# Altium project DEMO.PrjPcb
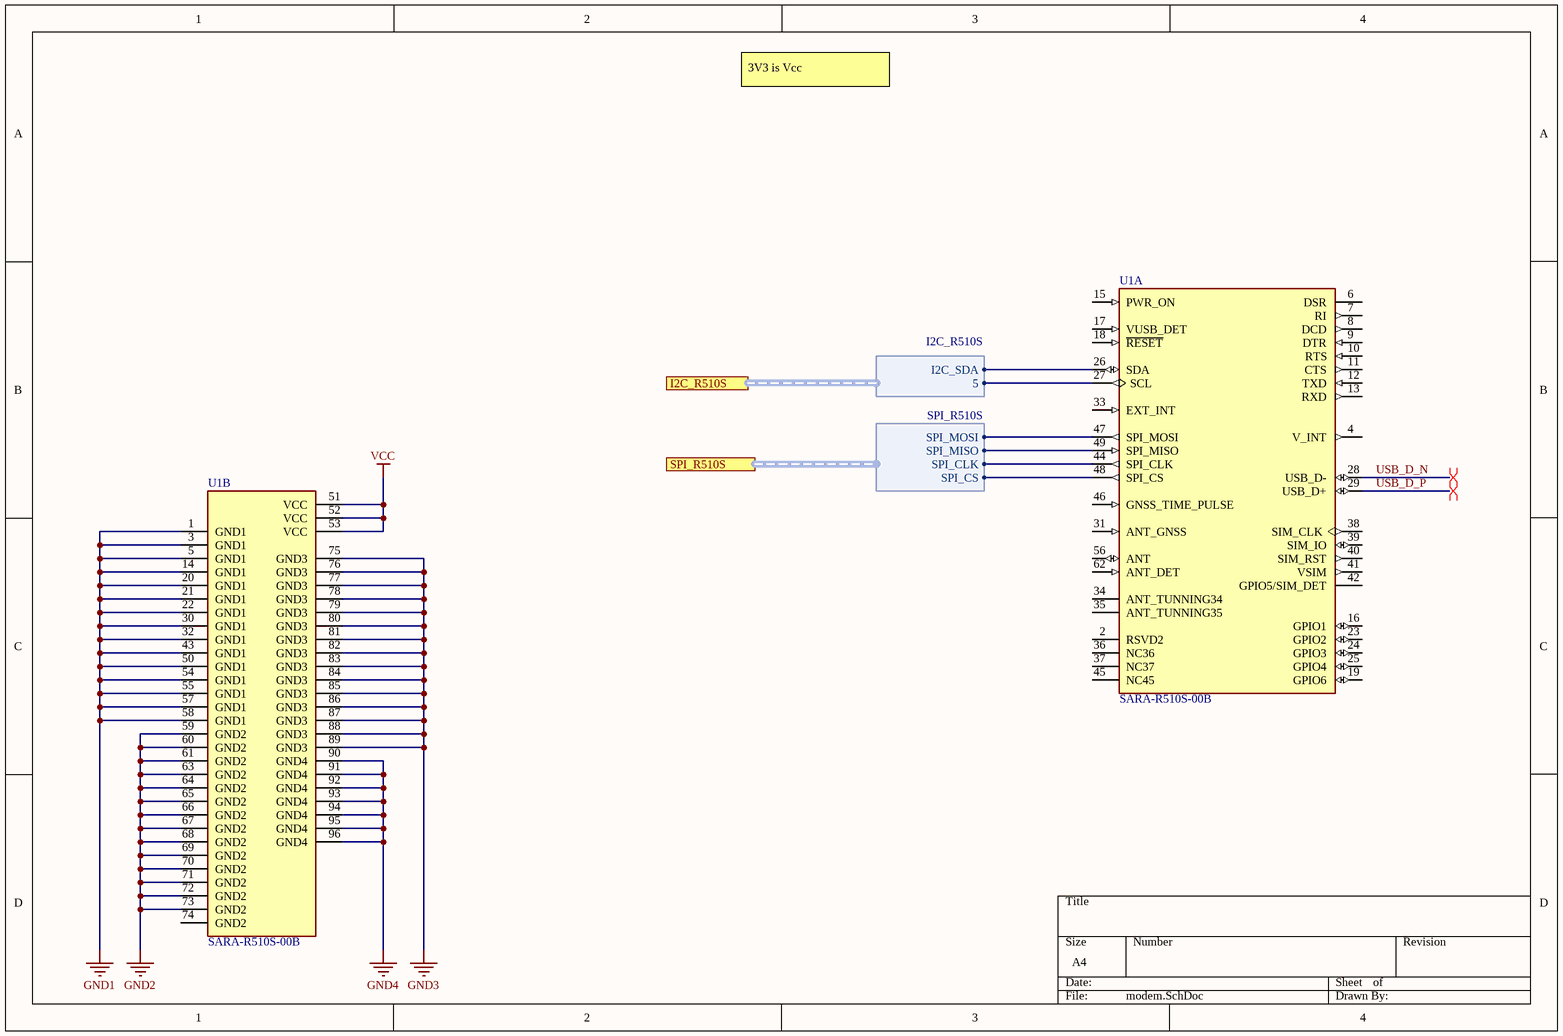
[diagram p0: modem.SchDoc]
9 sheets, 59 parts. Net scope: hierarchical (ports join the sheet entries above them; power ports are global).
Board file: TEST.PcbDoc
Sheets:
  modem.SchDoc
  nRF.SchDoc
  USB_C.SchDoc
  example connect.SchDoc
    Designator = ATMEGA328PB_example.SchDoc
    Designator = componant_example.SchDoc
    USB_in = USB_C2.SchDoc
    Designator = USB_to_UART.SchDoc
    Designator = SPI_8_bit display.SchDoc

## Sheet modem.SchDoc
size A4; SheetNumber: 1; SheetTotal: 1

### Parts
U1  SARA-R510S-00B  [MODULE_SARA-R510S-00B - CORRECTED]  (parts A,B of 2)

### Ports
I2C_R510S (harness I2C_R510S), SPI_R510S (harness SPI_R510S)

### Harnesses
SPI_R510S: SPI_MOSI, SPI_MISO, SPI_CLK, SPI_CS
I2C_R510S: I2C_SDA, 5

### Nets
GND1: U1.1(GND1) U1.3(GND1) U1.5(GND1) U1.14(GND1) U1.20(GND1) U1.21(GND1) U1.22(GND1) U1.30(GND1) U1.32(GND1) U1.43(GND1) U1.50(GND1) U1.54(GND1) U1.55(GND1) U1.57(GND1) U1.58(GND1)
GND2: U1.59(GND2) U1.60(GND2) U1.61(GND2) U1.63(GND2) U1.64(GND2) U1.65(GND2) U1.66(GND2) U1.67(GND2) U1.68(GND2) U1.69(GND2) U1.70(GND2) U1.71(GND2) U1.72(GND2) U1.73(GND2)
GND3: U1.75(GND3) U1.76(GND3) U1.77(GND3) U1.78(GND3) U1.79(GND3) U1.80(GND3) U1.81(GND3) U1.82(GND3) U1.83(GND3) U1.84(GND3) U1.85(GND3) U1.86(GND3) U1.87(GND3) U1.88(GND3) U1.89(GND3)
GND4: U1.90(GND4) U1.91(GND4) U1.92(GND4) U1.93(GND4) U1.94(GND4) U1.95(GND4) U1.96(GND4)
VCC: U1.51(VCC) U1.52(VCC) U1.53(VCC)
USB_D_N: U1.28(USB_D-)
USB_D_P: U1.29(USB_D+)
NetU1_26: U1.26(SDA) ; port I2C_R510S.I2C_SDA
NetU1_27: U1.27(SCL) ; port I2C_R510S.5
NetU1_44: U1.44(SPI_CLK) ; port SPI_R510S.SPI_CLK
NetU1_47: U1.47(SPI_MOSI) ; port SPI_R510S.SPI_MOSI
NetU1_48: U1.48(SPI_CS) ; port SPI_R510S.SPI_CS
NetU1_49: U1.49(SPI_MISO) ; port SPI_R510S.SPI_MISO

Not connected (* = marked no-connect by the designer): U1 2(RSVD2) 4(V_INT) 6(DSR) 7(RI) 8(DCD) 9(DTR) 10(RTS) 11(CTS) 12(TXD) 13(RXD) 15(PWR_ON) 16(GPIO1) 17(VUSB_DET) 18(~{RESET}) 19(GPIO6) 23(GPIO2) 24(GPIO3) 25(GPIO4) 31(ANT_GNSS) 33(EXT_INT) 34(ANT_TUNNING34) 35(ANT_TUNNING35) 36(NC36) 37(NC37) 38(SIM_CLK) 39(SIM_IO) 40(SIM_RST) 41(VSIM) 42(GPIO5/SIM_DET) 45(NC45) 46(GNSS_TIME_PULSE) 56(ANT) 62(ANT_DET) 74(GND2)

### Layout directives
differential pair: USB_D_N, USB_D_P

### Notes on the sheet
- 3V3 is Vcc

### Library data of the parts
U1 = SARA-R510S-00B: Cellular LTE Cat M1, LTE Cat NB2 Transceiver Module 600MHz, 700MHz, 750MHz, 800MHz, 850MHz, 900MHz, 1.7GHz, 1.8GHz, 1.9GHz, 2.1GHz Antenna Not Included Surface Mount; MF: U-Blox; Package: SMD-96 u-blox; Availability: In Stock; Value: *; MP: SARA-R510S-00B; Purchase-URL: https://pricing.snapeda.com/search/part/SARA-R510S-00B/?ref=eda; Check_prices: https://www.snapeda.com/parts/SARA-R510S-00B/u-blox/view-part/?ref=eda; SnapEDA_Link: https://www.snapeda.com/parts/SARA-R510S-00B/u-blox/view-part/?ref=snap; Price: None

## Sheet nRF.SchDoc
size A3; SheetNumber: 2; SheetTotal: 4
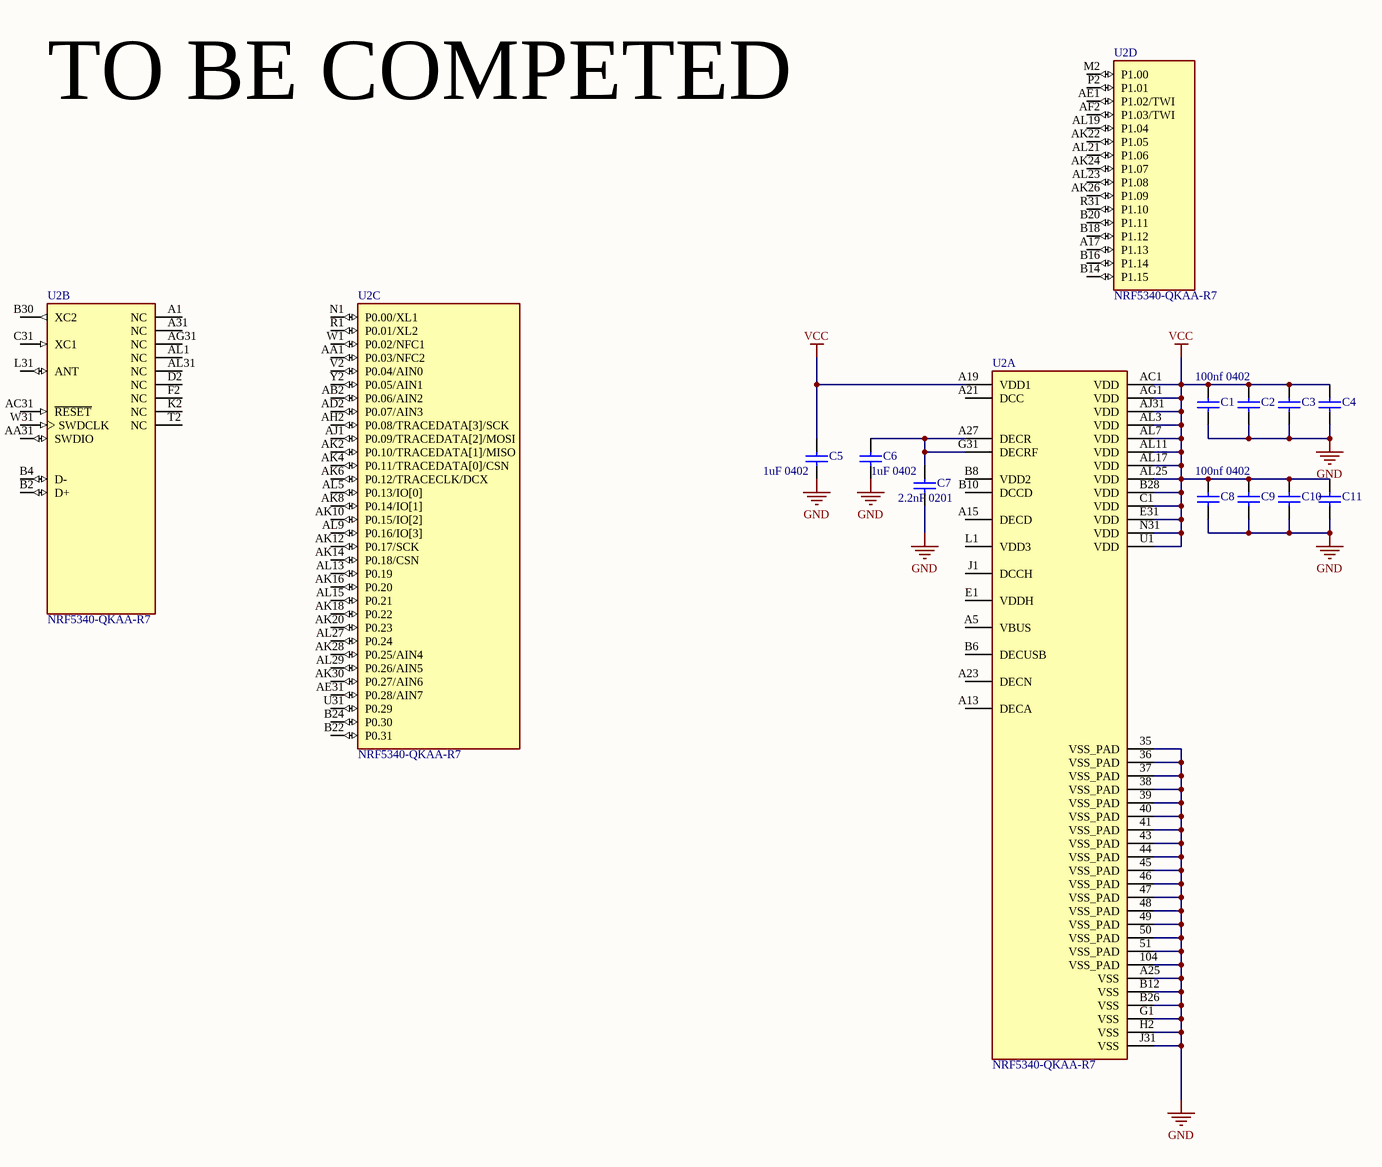
[diagram p1: nRF.SchDoc]

### Parts
C1  100nf 0402
C2  100nf 0402  (value not drawn)
C3  100nf 0402  (value not drawn)
C4  100nf 0402  (value not drawn)
C5  1uF 0402
C6  1uF 0402
C7  2.2nF 0201
C8  100nf 0402
C9  100nf 0402  (value not drawn)
C10  100nf 0402  (value not drawn)
C11  100nf 0402  (value not drawn)
U2  NRF5340-QKAA-R7  [XCVR_NRF5340-QKAA-R7]  (parts A,B,C,D of 4)

### Nets
GND: C1.1 C2.1 C3.1 C4.1 C5.1 C6.1 C7.1 C8.1 C9.1 C10.1 C11.1 U2.35(VSS_PAD) U2.36(VSS_PAD) U2.37(VSS_PAD) U2.38(VSS_PAD) U2.39(VSS_PAD) U2.40(VSS_PAD) U2.41(VSS_PAD) U2.43(VSS_PAD) U2.44(VSS_PAD) U2.45(VSS_PAD) U2.46(VSS_PAD) U2.47(VSS_PAD) U2.48(VSS_PAD) U2.49(VSS_PAD) U2.50(VSS_PAD) U2.51(VSS_PAD) U2.104(VSS_PAD) U2.A25(VSS) U2.B12(VSS) U2.B26(VSS) U2.G1(VSS) U2.H2(VSS) U2.J31(VSS)
VCC: C1.2 C2.2 C3.2 C4.2 C5.2 C8.2 C9.2 C10.2 C11.2 U2.A19(VDD1) U2.AC1(VDD) U2.AG1(VDD) U2.AJ31(VDD) U2.AL3(VDD) U2.AL7(VDD) U2.AL11(VDD) U2.AL17(VDD) U2.AL25(VDD) U2.B28(VDD) U2.C1(VDD) U2.E31(VDD) U2.N31(VDD) U2.U1(VDD)
NetC6_2: C6.2 C7.2 U2.A27(DECR) U2.G31(DECRF)

Not connected (* = marked no-connect by the designer): U2 A1(NC) A5(VBUS) A13(DECA) A15(DECD) A17(P1.13) A21(DCC) A23(DECN) A31(NC) AA1(P0.03/NFC2) AA31(SWDIO) AB2(P0.06/AIN2) AC31(~{RESET}) AD2(P0.07/AIN3) AE1(P1.02/TWI) AE31(P0.28/AIN7) AF2(P1.03/TWI) AG31(NC) AH2(P0.08/TRACEDATA[3]/SCK) AJ1(P0.09/TRACEDATA[2]/MOSI) AK2(P0.10/TRACEDATA[1]/MISO) AK4(P0.11/TRACEDATA[0]/CSN) AK6(P0.12/TRACECLK/DCX) AK8(P0.14/IO[1]) AK10(P0.15/IO[2]) AK12(P0.17/SCK) AK14(P0.18/CSN) AK16(P0.20) AK18(P0.22) AK20(P0.23) AK22(P1.05) AK24(P1.07) AK26(P1.09) AK28(P0.25/AIN4) AK30(P0.27/AIN6) AL1(NC) AL5(P0.13/IO[0]) AL9(P0.16/IO[3]) AL13(P0.19) AL15(P0.21) AL19(P1.04) AL21(P1.06) AL23(P1.08) AL27(P0.24) AL29(P0.26/AIN5) AL31(NC) B2(D+) B4(D-) B6(DECUSB) B8(VDD2) B10(DCCD) B14(P1.15) B16(P1.14) B18(P1.12) B20(P1.11) B22(P0.31) B24(P0.30) B30(XC2) C31(XC1) D2(NC) E1(VDDH) F2(NC) J1(DCCH) K2(NC) L1(VDD3) L31(ANT) M2(P1.00) N1(P0.00/XL1) P2(P1.01) R1(P0.01/XL2) R31(P1.10) T2(NC) U31(P0.29) V2(P0.04/AIN0) W1(P0.02/NFC1) W31(SWDCLK) Y2(P0.05/AIN1)

### Notes on the sheet
- TO BE COMPETED

### Library data of the parts
C1-C4 C8-C11 = 100nf 0402: Capacitor; Published: 8-Jun-2000; LatestRevisionDate: 17-Jul-2002; LatestRevisionNote: Re-released for DXP Platform.; PackageReference: RAD-0.3; Publisher: Altium Limited; PackageDescription: Radial Cap, Thru-Hole; 2 Leads; 0.3 in Pin Spacing
C5 C6 = 1uF 0402: Capacitor; Published: 8-Jun-2000; LatestRevisionDate: 17-Jul-2002; LatestRevisionNote: Re-released for DXP Platform.; PackageReference: RAD-0.3; Publisher: Altium Limited; PackageDescription: Radial Cap, Thru-Hole; 2 Leads; 0.3 in Pin Spacing
C7 = 2.2nF 0201: Capacitor; Published: 8-Jun-2000; LatestRevisionDate: 17-Jul-2002; LatestRevisionNote: Re-released for DXP Platform.; PackageReference: RAD-0.3; Publisher: Altium Limited; PackageDescription: Radial Cap, Thru-Hole; 2 Leads; 0.3 in Pin Spacing
U2 = NRF5340-QKAA-R7: RF System on a Chip - SoC Dual-core Bluetooth 5.2 SoC supporting Bluetooth Low Energy, Bluetooth mesh, NFC, Thread, and Zigbee; MF: Nordic Semiconductor ASA; Purchase-URL: https://pricing.snapeda.com/search/part/NRF5340-QKAA-R7/?ref=eda; Package: None; Check_prices: https://www.snapeda.com/parts/NRF5340-QKAA-R7/Nordic+Semiconductor+ASA/view-part/?ref=eda; Price: None; SnapEDA_Link: https://www.snapeda.com/parts/NRF5340-QKAA-R7/Nordic+Semiconductor+ASA/view-part/?ref=snap; Availability: In Stock; MP: NRF5340-QKAA-R7; Value: *

## Sheet USB_C.SchDoc
size A4; SheetNumber: 3; SheetTotal: 8
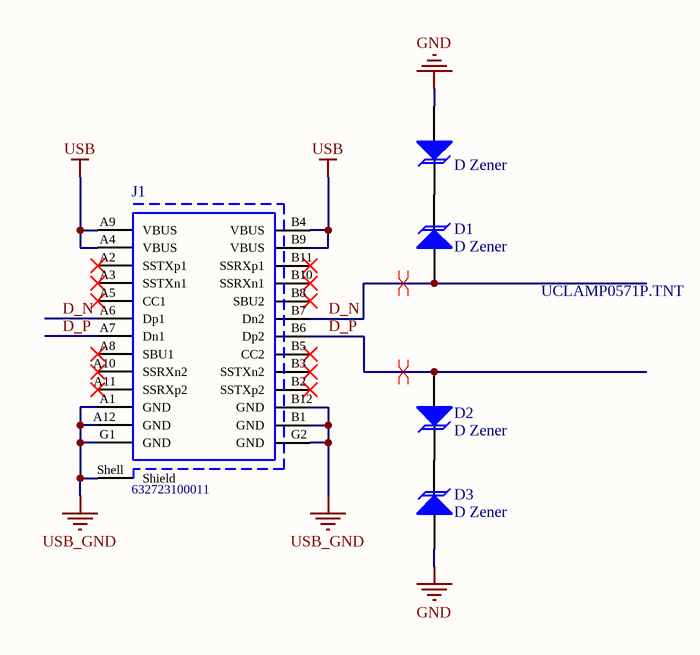
[diagram p2: USB_C.SchDoc]

### Parts
?  D Zener
D1  D Zener
D2  D Zener
D3  D Zener
J1  632723100011  [632723100011]

### Nets
GND: ?.1(A) D3.1(A)
USB: J1.A4(VBUS) J1.A9(VBUS) J1.B4(VBUS) J1.B9(VBUS)
USB_GND: J1.A1(GND) J1.A12(GND) J1.B1(GND) J1.B12(GND) J1.G1(GND) J1.G2(GND) J1.Shell(Shield)
D_N: D1.1(A) J1.A6(Dp1) J1.B7(Dn2)
D_P: D2.1(A) J1.A7(Dn1) J1.B6(Dp2)
Net?_2: ?.2(K) D1.2(K)
NetD2_2: D2.2(K) D3.2(K)

Not connected (* = marked no-connect by the designer): J1 A2(SSTXp1)* A3(SSTXn1)* A5(CC1)* A8(SBU1)* A10(SSRXn2)* A11(SSRXp2)* B2(SSTXp2)* B3(SSTXn2)* B5(CC2)* B8(SBU2)* B10(SSRXn1)* B11(SSRXp1)*

### Layout directives
differential pair: D_N, D_P

### Notes on the sheet
- UCLAMP0571P.TNT

### Library data of the parts
? D1-D3 = TVS (uni): TVS Diode; Published: 8-Jun-2000; LatestRevisionDate: 17-Jul-2002; LatestRevisionNote: Re-released for DXP Platform.; PackageReference: DIODE-0.7; Publisher: Altium Limited; PackageDescription: Diode, Thru-Hole; 2 Leads; 0.7 in Pin Spacing
J1 = CMP-1502-03213-1: USB 3.1 Type C Receptacle WR-COM, Horizontal, SMT / THT; Manufacturer: Wurth Elektronik; Working Voltage: 20VDC; Rated Current: 5A; Contact Resistance: 30mOhm; Operating Temperature: -40to105degC; Publisher: WurthElektronik; Gender: Receptacle; Part Number: 632723100011; Mounting Technology: SMT/THT; Datasheet URL: https://katalog.we-online.de/em/datasheet/632723x00011%282%29.pdf; Connector Type: USB3.1TypeC; Manufacturer URL: http://www.we-online.de; Orientation: Horizontal; Package Reference: 632723100011; Packaging: TapeandReel

## Sheet example connect.SchDoc
size A4; SheetNumber: 4; SheetTotal: 9
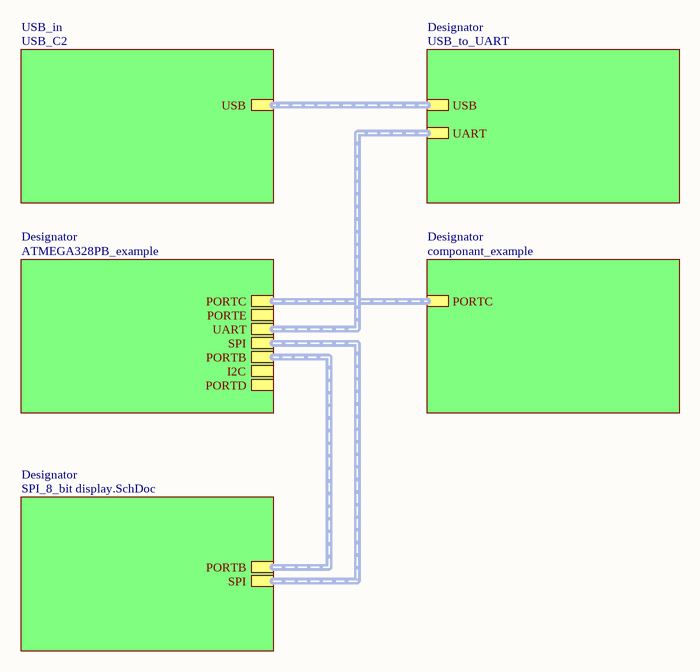
[diagram p3: example connect.SchDoc]

### Sub-sheets
Designator = ATMEGA328PB_example: PORTC (harness PORTC), PORTE (harness PORTE), UART (harness UART), SPI (harness SPI), PORTB (harness PORTB), I2C (harness I2C), PORTD (harness PORTD)
Designator = componant_example: PORTC (harness PORTC)
Designator = USB_to_UART: USB (harness USB), UART (harness UART)
Designator = SPI_8_bit display.SchDoc: SPI (harness SPI), PORTB (harness PORTB)
USB_in = USB_C2: USB (harness USB)

### Buses and harness runs
harness sheet Designator/USB = sheet USB_in/USB

## Sheet ATMEGA328PB_example.SchDoc
size A3; SheetNumber: 6; SheetTotal: 8
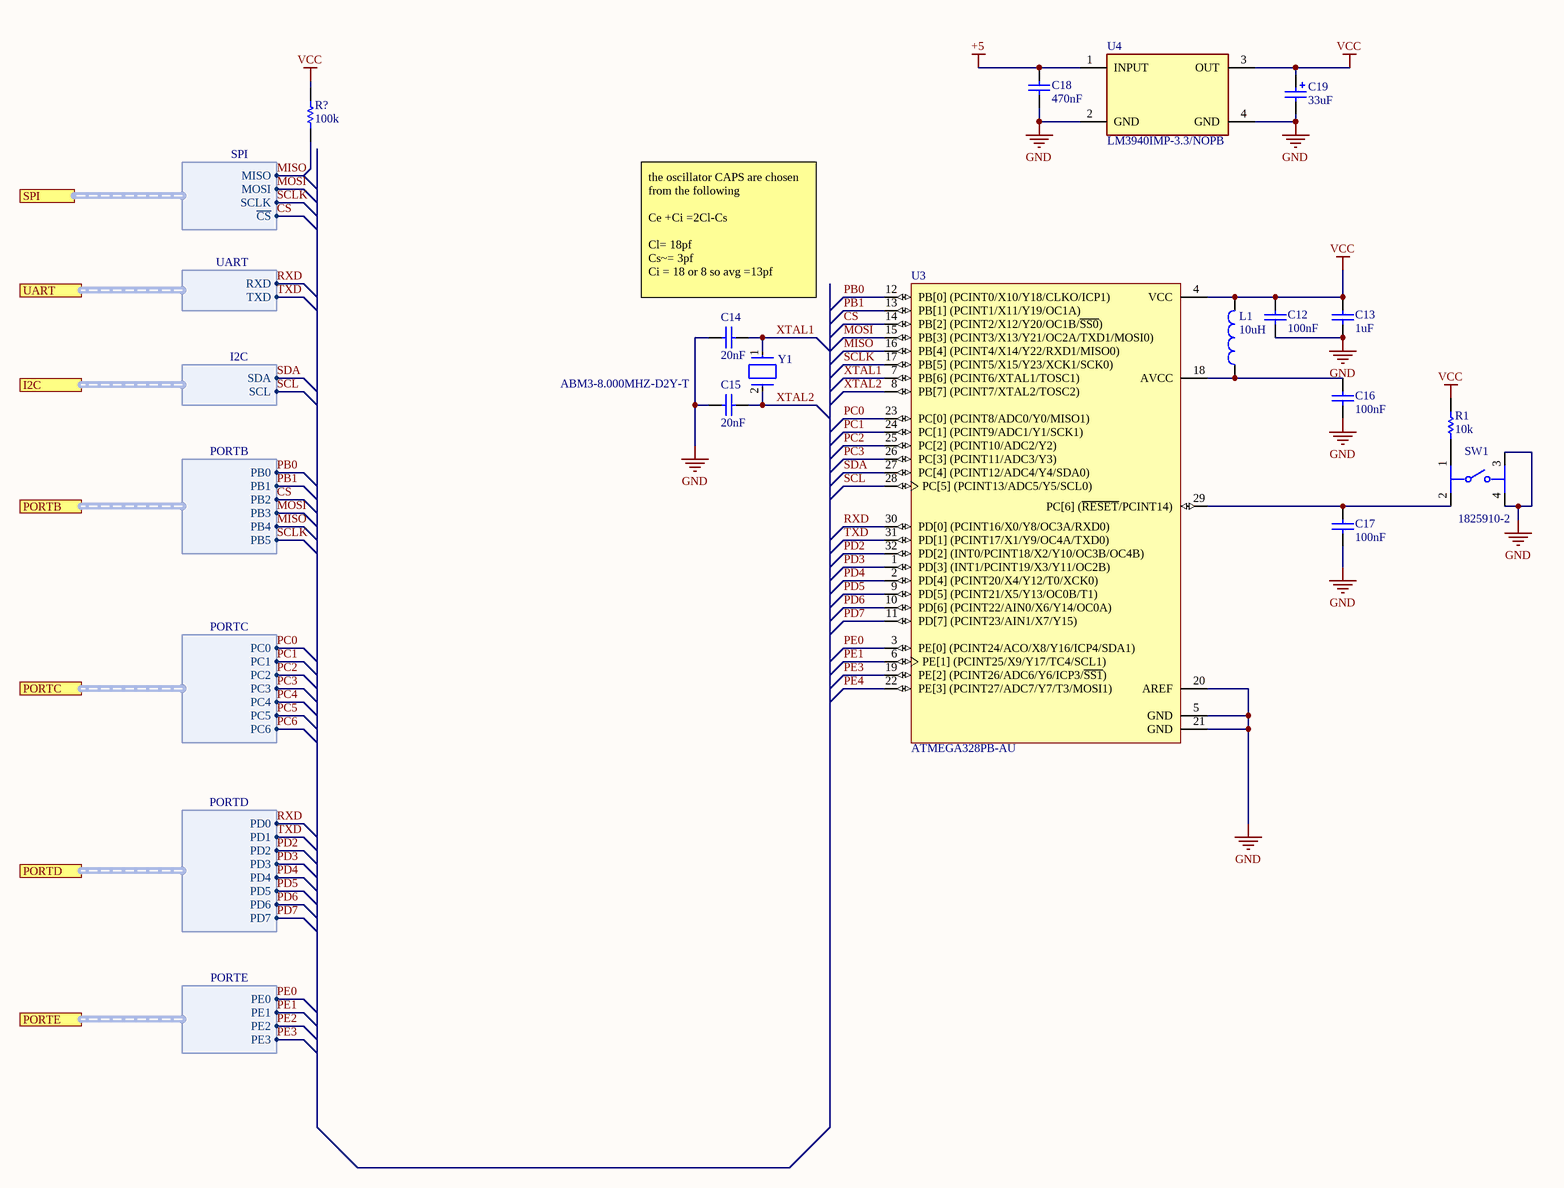
[diagram p4: ATMEGA328PB_example.SchDoc]

### Parts
(Parts that share a designator on the sheet are numbered #1, #2 ... from top to bottom, then left to right.)
C12  100nF
C13  1uF
C14  20nF
C15  20nF
C16  100nF
C17  100nF
C18  470nF
C19  33uF
L1  10uH  [0402-A]
R1  10k
R?#1  100k
SW1  1825910-2  [FP-1825910-2-0]
U3  ATMEGA328PB-AU  [ATML-32A_M]
U4  LM3940IMP-3.3/NOPB  [FP-DCY0004A-MFG]
Y1  ABM3-8.000MHZ-D2Y-T  [FP-ABM3-MFG]

### Ports
I2C (harness I2C), PORTB (harness PORTB), PORTC (harness PORTC), PORTD (harness PORTD), PORTE (harness PORTE), SPI (harness SPI), UART (harness UART)

### Harnesses
SPI: MISO, MOSI, SCLK, ~{CS}
UART: RXD, TXD
I2C: SDA, SCL
PORTB: PB0, PB1, PB2, PB3, PB4, PB5
PORTC: PC0, PC1, PC2, PC3, PC4, PC5, PC6
PORTD: PD0, PD1, PD2, PD3, PD4, PD5, PD6, PD7
PORTE: PE0, PE1, PE2, PE3

### Nets
+5: C18.2 U4.1(INPUT)
GND: C12.1 C13.1 C14.2 C15.2 C16.1 C17.1 C18.1 C19.2 SW1.3 SW1.4 U3.5(GND) U3.20(AREF) U3.21(GND) U4.2(GND) U4.4(GND)
VCC: C12.2 C13.2 C19.1 L1.2 R1.2 R?#1.2 U3.4(VCC) U4.3(OUT)
~{CS}: U3.14(PB[2]_(PCINT2/X12/Y20/OC1B/~{SS0})) ; port SPI.~{CS}
CS: port PORTB.PB2
MISO: R?#1.1 U3.16(PB[4]_(PCINT4/X14/Y22/RXD1/MISO0)) ; port SPI.MISO, port PORTB.PB4
MOSI: U3.15(PB[3]_(PCINT3/X13/Y21/OC2A/TXD1/MOSI0)) ; port SPI.MOSI, port PORTB.PB3
PB0: U3.12(PB[0]_(PCINT0/X10/Y18/CLKO/ICP1)) ; port PORTB.PB0  [project net CS]
PB1: U3.13(PB[1]_(PCINT1/X11/Y19/OC1A)) ; port PORTB.PB1
PC0: U3.23(PC[0]_(PCINT8/ADC0/Y0/MISO1)) ; port PORTC.PC0
PC1: U3.24(PC[1]_(PCINT9/ADC1/Y1/SCK1)) ; port PORTC.PC1
PC2: U3.25(PC[2]_(PCINT10/ADC2/Y2)) ; port PORTC.PC2
PC3: U3.26(PC[3]_(PCINT11/ADC3/Y3)) ; port PORTC.PC3
PC4: port PORTC.PC4
PC5: port PORTC.PC5
PC6: port PORTC.PC6
PD2: U3.32(PD[2]_(INT0/PCINT18/X2/Y10/OC3B/OC4B)) ; port PORTD.PD2
PD3: U3.1(PD[3]_(INT1/PCINT19/X3/Y11/OC2B)) ; port PORTD.PD3
PD4: U3.2(PD[4]_(PCINT20/X4/Y12/T0/XCK0)) ; port PORTD.PD4
PD5: U3.9(PD[5]_(PCINT21/X5/Y13/OC0B/T1)) ; port PORTD.PD5
PD6: U3.10(PD[6]_(PCINT22/AIN0/X6/Y14/OC0A)) ; port PORTD.PD6
PD7: U3.11(PD[7]_(PCINT23/AIN1/X7/Y15)) ; port PORTD.PD7
PE0: U3.3(PE[0]_(PCINT24/ACO/X8/Y16/ICP4/SDA1)) ; port PORTE.PE0
PE1: U3.6(PE[1]_(PCINT25/X9/Y17/TC4/SCL1)) ; port PORTE.PE1
PE2: port PORTE.PE2
PE3: U3.19(PE[2]_(PCINT26/ADC6/Y6/ICP3/~{SS1})) ; port PORTE.PE3
PE4: U3.22(PE[3]_(PCINT27/ADC7/Y7/T3/MOSI1))
RXD: U3.30(PD[0]_(PCINT16/X0/Y8/OC3A/RXD0)) ; port UART.RXD, port PORTD.PD0
SCL: U3.28(PC[5]_(PCINT13/ADC5/Y5/SCL0)) ; port I2C.SCL
SCLK: U3.17(PB[5]_(PCINT5/X15/Y23/XCK1/SCK0)) ; port SPI.SCLK, port PORTB.PB5
SDA: U3.27(PC[4]_(PCINT12/ADC4/Y4/SDA0)) ; port I2C.SDA
TXD: U3.31(PD[1]_(PCINT17/X1/Y9/OC4A/TXD0)) ; port UART.TXD, port PORTD.PD1
XTAL1: C14.1 U3.7(PB[6]_(PCINT6/XTAL1/TOSC1)) Y1.1
XTAL2: C15.1 U3.8(PB[7]_(PCINT7/XTAL2/TOSC2)) Y1.2
NetC16_2: C16.2 L1.1 U3.18(AVCC)
NetC17_2: C17.2 SW1.2 U3.29(PC[6]_(~{RESET}/PCINT14))
NetR1_1: R1.1 SW1.1

### Notes on the sheet
- the oscillator CAPS are chosen from the following
  Ce +Ci =2Cl-Cs
  Cl= 18pf
  Cs~= 3pf
  Ci = 18 or 8 so avg =13pf

### Library data of the parts
C12 C16 C17 = 100nF: Capacitor; Published: 8-Jun-2000; LatestRevisionDate: 17-Jul-2002; LatestRevisionNote: Re-released for DXP Platform.; PackageReference: RAD-0.3; Publisher: Altium Limited; PackageDescription: Radial Cap, Thru-Hole; 2 Leads; 0.3 in Pin Spacing
C13 = 1uF: Capacitor; Published: 8-Jun-2000; LatestRevisionDate: 17-Jul-2002; LatestRevisionNote: Re-released for DXP Platform.; PackageReference: RAD-0.3; Publisher: Altium Limited; PackageDescription: Radial Cap, Thru-Hole; 2 Leads; 0.3 in Pin Spacing
C14 C15 = 20nF: Capacitor; Published: 8-Jun-2000; LatestRevisionDate: 17-Jul-2002; LatestRevisionNote: Re-released for DXP Platform.; PackageReference: RAD-0.3; Publisher: Altium Limited; PackageDescription: Radial Cap, Thru-Hole; 2 Leads; 0.3 in Pin Spacing
C18 = 470nF: Capacitor; Published: 8-Jun-2000; LatestRevisionDate: 17-Jul-2002; LatestRevisionNote: Re-released for DXP Platform.; PackageReference: RAD-0.3; Publisher: Altium Limited; PackageDescription: Radial Cap, Thru-Hole; 2 Leads; 0.3 in Pin Spacing
C19 = 33uF: Polarized Capacitor; Published: 8-Jun-2000; LatestRevisionDate: 29-May-2009; LatestRevisionNote: IPC-7351 Footprint Added.; PackageReference: C0805; Publisher: Altium Limited; PackageDescription: Chip Capacitor
L1 = 10uH: Inductor; Code_IEC: 1005; Published: 8-Jun-2000; LatestRevisionDate: 29-May-2009; LatestRevisionNote: IPC-7351 Footprint Added.; PackageReference: 0402-A; Publisher: Altium Limited; PackageDescription: Chip Inductor; Code_JEITA: 0402
R1 = 10k: Resistor; Published: 8-Jun-2000; LatestRevisionDate: 17-Jul-2002; LatestRevisionNote: Re-released for DXP Platform.; PackageReference: AXIAL-0.3; Publisher: Altium Limited; PackageDescription: Axial Device, Thru-Hole; 2 Leads; 0.3 in Pin Spacing
R?#1 = 100k: 100k Resistor; Published: 8-Jun-2000; LatestRevisionDate: 17-Jul-2002; LatestRevisionNote: Re-released for DXP Platform.; PackageReference: AXIAL-0.3; Publisher: Altium Limited; PackageDescription: Axial Device, Thru-Hole; 2 Leads; 0.3 in Pin Spacing
SW1 = CMP-03407-000004-1: SWITCH TACTILE SPST-NO 0.05A 24V; Manufacturer: TE; Contact Current Rating: 50mA; Operating Force: 160gf; Contact Resistance: 100mΩ; Electromechanical Life: 100000Cycles; Package: 0; ComponentLink2Description: Datasheet; Digikey Description: SWITCH TACTILE SPST-NO 0.05A 24V; Octopart: https://octopart.com/1825910-2-te+connectivity-42270502; Temperature Range Low: -35°C; Temperature Range High: +85°C; Lead Free: Yes; Device Class L2: Switches; Automotive: No; Temperature: -35°C to +85°C; Device Class L1: Electromechanical; Category: Switch; ComponentLink2URL: https://www.te.com/commerce/DocumentDelivery/DDEController?Action=showdoc&DocId=Customer+Drawing%7F1825910%7FC10%7Fpdf%7FEnglish%7FENG_CD_1825910_C10.pdf%7F1825910-2; Mount: Through Hole; RoHS: TRUE; Height: 4.6mm; Manufacturer Part Number: 1825910-2; Device Class L3: Tactile Switches; Voltage Rating Dc: 24V; Throw Configuration: SPST-NO
U3 = CMP-2000-07439-1: AVR Microcontroller, 1.8 to 5.5 V, 32 KB Flash, 1 KB EEPROM, 2 KB SRAM, -40 to 85 degC, 32-Pin TQFP (32A), RoHS, Tray; Manufacturer: Microchip; Datasheet URL: http://ww1.microchip.com/downloads/en/DeviceDoc/40001906A.pdf; Mounting Technology: SurfaceMount; RoHSCompliant: false; Manufacturer URL: http://www.microchip.com/; Package Description: 32-Pin Thin Profile Plastic Quad Flat Package, Body 7 x 7 mm, Pitch 0.8 mm; Package Reference: 32A; Datasheet Version: Rev. A, 04/2017
U4 = CMP-0062-01788-4: IC REG LINEAR 3.3V 1A SOT223-4; Min Input Voltage: 4.5V; Max Supply Voltage: 7.5V; Number of Outputs: 1; Output Type: Fixed; Polarity: Positive; Dropout Voltage: 500mV; Quiescent Current: 15mA; Max Output Voltage: 3.3V; Length: 6.5mm; Termination: SMD/SMT; Width: 3.56mm; Min Supply Voltage: 4.5V; Max Output Current: 1A; Case/Package: SOT-223; Output Voltage: 3.3V; Current Rating: 1A; Packaging: Tape and Reel; Lead Free: Lead Free; Nominal Output Voltage: 3.3V; Height: 1.6mm; Series: -; Output Configuration: Positive; Radiation Hardening: No; Number of Regulators: 1; Package Quantity: 1000; REACH SVHC: No SVHC; Max Input Voltage: 7.5V; Max Operating Temperature: 125°C; Min Operating Temperature: -40°C; Output Current: 1A; Contact Plating: Tin; Number of Pins: 4; Mount: Surface Mount
Y1 = CMP-2000-05033-2: Crystal 8MHz ±20ppm 18pF SMD-2 5mm x 3.2mm; Series Resistance: 500R; Frequency Stability: 30ppm; ESR (Equivalent Series Resistance): 140R; Load Capacitance: 18pF; Height: 0.051inch; Tolerance: 20ppm; Depth: 3.2mm; Max Operating Temperature: 85°C; Frequency: 8MHz; Termination: SMD/SMT; Lead Free: Lead Free; Number of Pins: 2; Width: 3.2mm; RoHS Compliant: Yes; Resistor Type: Ceramic; Length: 5mm; Mount: Surface Mount; Case/Package: CSMD; Package Quantity: 1000; Radiation Hardening: No; Min Operating Temperature: -40°C; Packaging: Tape and Reel; Frequency Tolerance: 20ppm

## Sheet componant_example.SchDoc
size A4; SheetNumber: 5; SheetTotal: 6
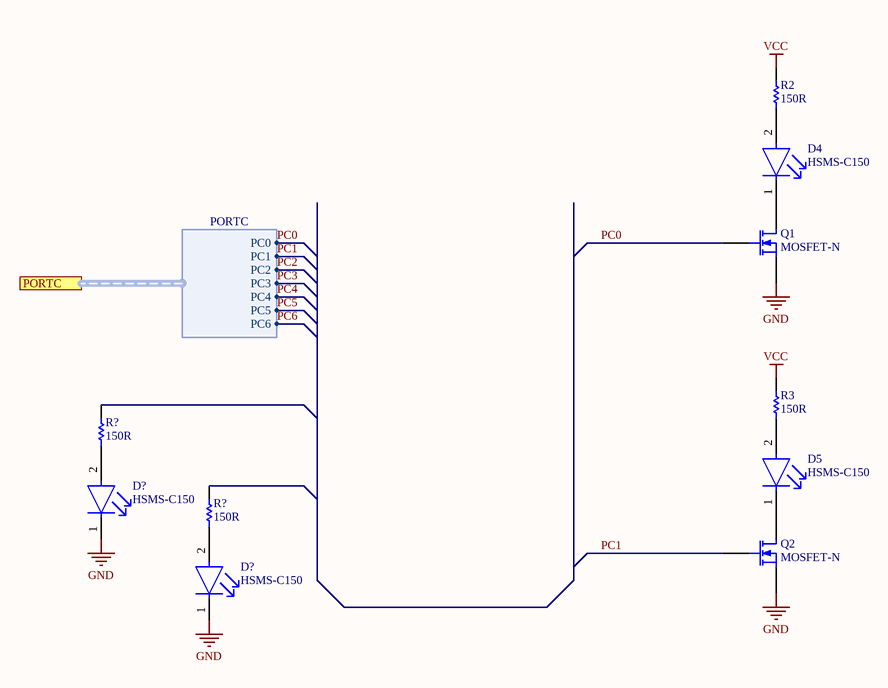
[diagram p5: componant_example.SchDoc]

### Parts
(Parts that share a designator on the sheet are numbered #1, #2 ... from top to bottom, then left to right.)
D4  HSMS-C150  [FP-HSMS-C150-MFG]
D5  HSMS-C150  [FP-HSMS-C150-MFG]
D?#1  HSMS-C150  [FP-HSMS-C150-MFG]
D?#2  HSMS-C150  [FP-HSMS-C150-MFG]
Q1  MOSFET-N
Q2  MOSFET-N
R2  150R  [RES 0603 SILK]
R3  150R  [RES 0603 SILK]
R?#2  150R  [RES 0603 SILK]
R?#3  150R  [RES 0603 SILK]

### Ports
PORTC (harness PORTC)

### Harnesses
PORTC: PC0, PC1, PC2, PC3, PC4, PC5, PC6

### Nets
GND: D?#1.1(C) D?#2.1(C) Q1.3(S) Q2.3(S)
VCC: R2.2 R3.2
PC0: Q1.2(G) ; port PORTC.PC0
PC1: Q2.2(G) ; port PORTC.PC1
PC4: port PORTC.PC4
PC5: port PORTC.PC5
PC6: port PORTC.PC6
NetD4_1: D4.1(C) Q1.1(D)
NetD4_2: D4.2(A) R2.1
NetD5_1: D5.1(C) Q2.1(D)
NetD5_2: D5.2(A) R3.1
NetD?#1_2: D?#1.2(A) R?#2.1
NetD?#2_2: D?#2.2(A) R?#3.1

Not connected (* = marked no-connect by the designer): R?#2 2; R?#3 2

### Library data of the parts
D4 D5 D?#1 D?#2 = CMP-21615-000001-1: LED RED DIFFUSED CHIP SMD; Luminous Intensity: 10mcd; Power Dissipation: 65mW; Viewing Angle: 170°; Number of Elements: 1; Forward Current: 20mA; Lens Color: White; Lens Style: Rectangular; Wavelength: 626nm; Forward Voltage: 2.1V; Reverse Voltage: 5V; Number of Pins: 2; Color: Red; Lead Free: Lead Free; Width: 1.6mm; Length: 3.2mm; REACH SVHC: No SVHC; Height: 1.1mm; Depth: 1.6mm; Power Rating: 65mW; Package Quantity: 1; Illumination Color: Red; Radiation Hardening: No; Case Code (Imperial): 1206; Max Operating Temperature: 85°C; Test Current: 20mA; Case/Package: 1206; Lens Transparency: Diffused; Number of LEDs: 1; Packaging: Tape and Reel; Mount: Surface Mount; Min Operating Temperature: -40°C; Case Code (Metric): 3216; Dominant Wavelength: 626nm
Q1 Q2 = 2N7002: N-Channel MOSFET / 2N7002,215 (SOT23) package; Published: 8-Jun-2000; LatestRevisionDate: 17-Jul-2002; LatestRevisionNote: Re-released for DXP Platform.; PackageVersion: 1995/1996; PackageReference: E3; Publisher: Altium Limited; PackageDescription: TO, Flat Index; 3 In-Line, Axial Leads; Body Dia. 4.6mm; Lead Dia. 0.5 mm (max)
R2 R3 R?#2 R?#3 = 150R: Resistor; Published: 8-Jun-2000; LatestRevisionDate: 17-Jul-2002; LatestRevisionNote: Re-released for DXP Platform.; PackageReference: AXIAL-0.3; Publisher: Altium Limited; PackageDescription: Axial Device, Thru-Hole; 2 Leads; 0.3 in Pin Spacing

## Sheet USB_C2.SchDoc
size A4; SheetNumber: 7; SheetTotal: 8
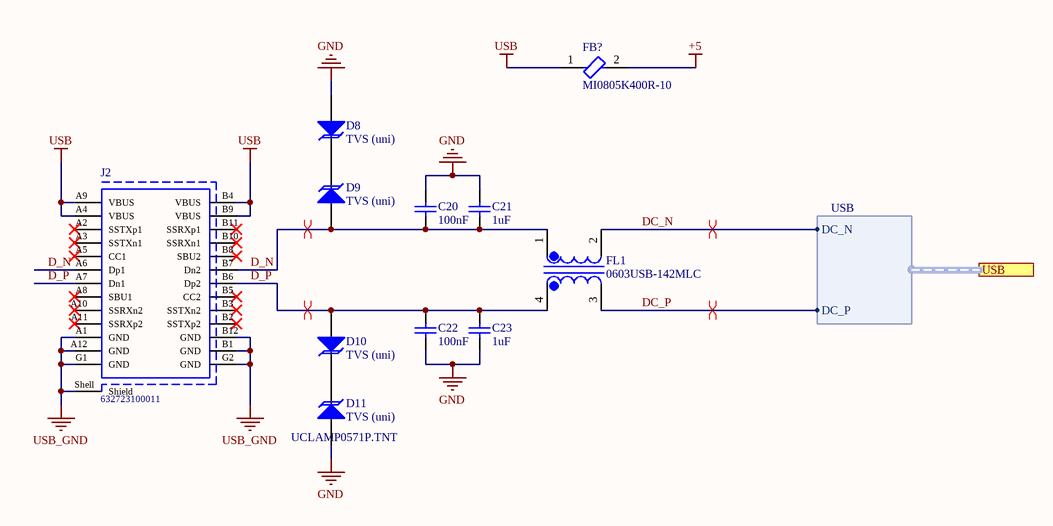
[diagram p6: USB_C2.SchDoc]

### Parts
C20  100nF
C21  1uF
C22  100nF
C23  1uF
D8  TVS (uni)
D9  TVS (uni)
D10  TVS (uni)
D11  TVS (uni)
FB?  MI0805K400R-10  [FP-MI0805-MFG]
FL1  0603USB-142MLC  [FIL_0603USB-142MLC]
J2  632723100011  [632723100011]

### Ports
USB (harness USB)

### Harnesses
USB: DC_N, DC_P

### Nets
+5: FB?.2
GND: C20.2 C21.2 C22.1 C23.1 D8.1(A) D11.1(A)
USB: FB?.1 J2.A4(VBUS) J2.A9(VBUS) J2.B4(VBUS) J2.B9(VBUS)
USB_GND: J2.A1(GND) J2.A12(GND) J2.B1(GND) J2.B12(GND) J2.G1(GND) J2.G2(GND) J2.Shell(Shield)
D_N: C20.1 C21.1 D9.1(A) FL1.1 J2.A6(Dp1) J2.B7(Dn2)
D_P: C22.2 C23.2 D10.1(A) FL1.4 J2.A7(Dn1) J2.B6(Dp2)
DC_N: FL1.2 ; port USB.DC_N
DC_P: FL1.3 ; port USB.DC_P
NetD8_2: D8.2(K) D9.2(K)
NetD10_2: D10.2(K) D11.2(K)

Not connected (* = marked no-connect by the designer): J2 A2(SSTXp1)* A3(SSTXn1)* A5(CC1)* A8(SBU1)* A10(SSRXn2)* A11(SSRXp2)* B2(SSTXp2)* B3(SSTXn2)* B5(CC2)* B8(SBU2)* B10(SSRXn1)* B11(SSRXp1)*

### Layout directives
differential pair: D_N, D_P, DC_N, DC_P

### Notes on the sheet
- (near D11) UCLAMP0571P.TNT

### Library data of the parts
C20 C22 = 100nF: Capacitor; Published: 8-Jun-2000; LatestRevisionDate: 17-Jul-2002; LatestRevisionNote: Re-released for DXP Platform.; PackageReference: RAD-0.3; Publisher: Altium Limited; PackageDescription: Radial Cap, Thru-Hole; 2 Leads; 0.3 in Pin Spacing
C21 C23 = 1uF: Capacitor; Published: 8-Jun-2000; LatestRevisionDate: 17-Jul-2002; LatestRevisionNote: Re-released for DXP Platform.; PackageReference: RAD-0.3; Publisher: Altium Limited; PackageDescription: Radial Cap, Thru-Hole; 2 Leads; 0.3 in Pin Spacing
D8-D11 = TVS (uni): TVS Diode; Published: 8-Jun-2000; LatestRevisionDate: 17-Jul-2002; LatestRevisionNote: Re-released for DXP Platform.; PackageReference: DIODE-0.7; Publisher: Altium Limited; PackageDescription: Diode, Thru-Hole; 2 Leads; 0.7 in Pin Spacing
FB? = CMP-2000-06702-2: FERRITE BEAD 40 OHM 0805 1LN; Impedance: 40R; Max Current Rating: 1.5A; Tolerance: 25%; Test Frequency: 100MHz; DC Resistance (DCR): 50mR; Number of Lines: 1; Min Operating Temperature: -40°C; Case/Package: 0805; Depth: 1.45mm; Current Rating: 1.5A; Width: 0.049inch; Core Material: Ferrite; Termination: SMD/SMT; Case Code (Imperial): 0805; Packaging: Tape and Reel; Weight: 0.00392oz; Lead Free: Lead Free; Length: 2mm; Max Operating Temperature: 125°C; Mount: Surface Mount; Case Code (Metric): 2012; Frequency: 100MHz; Height: 0.043inch; Package Quantity: 1; Material: Ferrite; Contact Plating: Tin; Max DC Current: 1.5A
FL1 = 0603USB-142MLC: Common mode filter, USB/IEEE 1394, SMT, RoHS mon mode filter, USB/IEEE 1394, SMT, RoHS; Package: None; Price: None; Value: *; MP: 0603USB-142MLC; Availability: Unavailable
J2 = CMP-1502-03213-1: as J1 on sheet USB_C; Operating Temperature: -40to105degC; Publisher: WurthElektronik; Gender: Receptacle; Part Number: 632723100011; Mounting Technology: SMT/THT; Datasheet URL: https://katalog.we-online.de/em/datasheet/632723x00011%282%29.pdf; Connector Type: USB3.1TypeC; Manufacturer URL: http://www.we-online.de; Orientation: Horizontal; Package Reference: 632723100011; Packaging: TapeandReel

## Sheet USB_to_UART.SchDoc
size A4; SheetNumber: 8; SheetTotal: 8
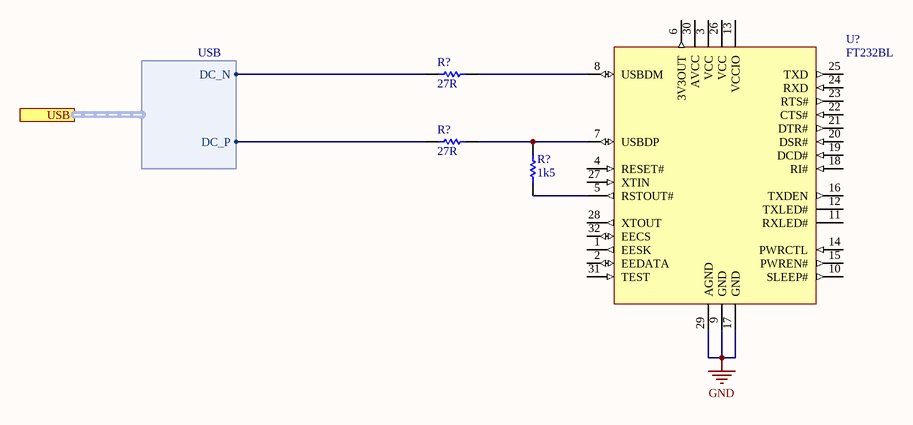
[diagram p7: USB_to_UART.SchDoc]

### Parts
(Parts that share a designator on the sheet are numbered #1, #2 ... from top to bottom, then left to right.)
R?#4  27R
R?#5  27R
R?#6  1k5
U?#1  FT232BL  [LQFP-32_L]

### Ports
USB (harness USB)

### Harnesses
USB: DC_N, DC_P

### Nets
GND: U?#1.9(GND) U?#1.17(GND) U?#1.29(AGND)
DC_N: R?#4.1 ; port USB.DC_N
DC_P: R?#5.1 ; port USB.DC_P
NetR?#4_2: R?#4.2 U?#1.8(USBDM)
NetR?#5_2: R?#5.2 R?#6.2 U?#1.7(USBDP)
NetR?#6_1: R?#6.1 U?#1.5(RSTOUT#)

Not connected (* = marked no-connect by the designer): U?#1 1(EESK) 2(EEDATA) 3(VCC) 4(RESET#) 6(3V3OUT) 10(SLEEP#) 11(RXLED#) 12(TXLED#) 13(VCCIO) 14(PWRCTL) 15(PWREN#) 16(TXDEN) 18(RI#) 19(DCD#) 20(DSR#) 21(DTR#) 22(CTS#) 23(RTS#) 24(RXD) 25(TXD) 26(VCC) 27(XTIN) 28(XTOUT) 30(AVCC) 31(TEST) 32(EECS)

### Library data of the parts
R?#4 R?#5 = 27R: Resistor; Published: 8-Jun-2000; LatestRevisionDate: 17-Jul-2002; LatestRevisionNote: Re-released for DXP Platform.; PackageReference: AXIAL-0.3; Publisher: Altium Limited; PackageDescription: Axial Device, Thru-Hole; 2 Leads; 0.3 in Pin Spacing
R?#6 = 1k5: Resistor; Published: 8-Jun-2000; LatestRevisionDate: 17-Jul-2002; LatestRevisionNote: Re-released for DXP Platform.; PackageReference: AXIAL-0.3; Publisher: Altium Limited; PackageDescription: Axial Device, Thru-Hole; 2 Leads; 0.3 in Pin Spacing
U?#1 = CMP-0078-00024-3: USB UART Asynchronous Serial Data Transfer Chip, 0 to +70 degC, 32-pin LQFP, Pb-Free; Manufacturer: FTDI; DatasheetVersion: ver 2.2, Nov-2011; ComponentLink2URL: http://www.ftdichip.com/Support/Documents/DataSheets/ICs/DS_FT232BL_BQ.pdf; ComponentLink1Description: Manufacturer URL; PackageVersion: Nov-11; PackageDescription: 32-Pin Thin Quad Flat Pack, 7 x 7 mm Body, 0.8 mm Pitch; PackageReference: LQFP-32; PartNumber: FT232BL; ComponentLink2Description: Datasheet; ComponentLink1URL: http://www.ftdichip.com/

## Sheet SPI_8_bit display.SchDoc
size A4; SheetNumber: 9; SheetTotal: 9
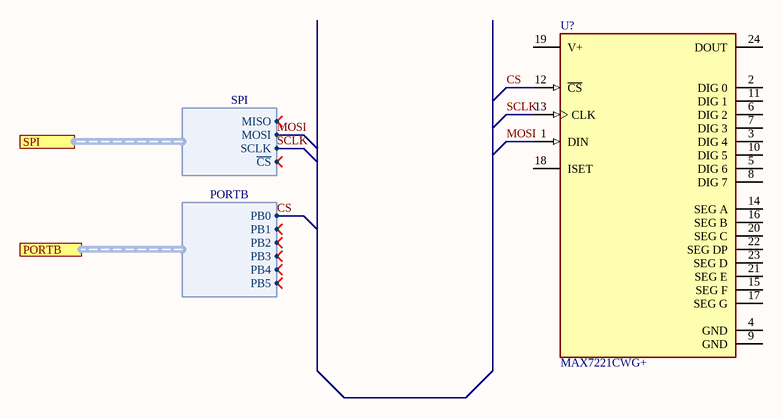
[diagram p8: SPI_8_bit display.SchDoc]

### Parts
(Parts that share a designator on the sheet are numbered #1, #2 ... from top to bottom, then left to right.)
U?#2  MAX7221CWG+  [FP-W24-1-MFG]

### Ports
PORTB (harness PORTB), SPI (harness SPI)

### Harnesses
SPI: MISO, MOSI, SCLK, ~{CS}
PORTB: PB0, PB1, PB2, PB3, PB4, PB5

### Nets
CS: U?#2.12(~{CS}) ; port PORTB.PB0
MISO: port SPI.MISO, port PORTB.PB4
MOSI: U?#2.1(DIN) ; port SPI.MOSI, port PORTB.PB3
SCLK: U?#2.13(CLK) ; port SPI.SCLK, port PORTB.PB5

Not connected (* = marked no-connect by the designer): U?#2 2(DIG_0) 3(DIG_4) 4(GND) 5(DIG_6) 6(DIG_2) 7(DIG_3) 8(DIG_7) 9(GND) 10(DIG_5) 11(DIG_1) 14(SEG_A) 15(SEG_F) 16(SEG_B) 17(SEG_G) 18(ISET) 19(V+) 20(SEG_C) 21(SEG_E) 22(SEG_DP) 23(SEG_D) 24(DOUT)

### Library data of the parts
U?#2 = CMP-05718-000002-1: IC DRVR 7 SEGMNT 8 DIGIT 24SOIC; Manufacturer: Maxim Integrated; Nominal Supply Current: 330mA; Max Power Dissipation: 941mW; Standoff Height: 0.1mm; Min Supply Voltage: 4V; Max Supply Voltage: 5.5V; Description: LED Driver 24-SOIC; Max Junction Temp: +150°C; Number Of Outputs: 8; Lead Free: Yes; Device Class L2: Power Management ICs; Height: 2.65mm; Temperature: 0°C to +70°C; Category: IC; Ipc Land Pattern Name: SOIC127P1032X250-24; Temperature Range High: +70°C; Package: W24-1; Manufacturer Part Number: MAX7221CWG+; Device Class L3: LED Drivers; ComponentLink2URL: https://datasheets.maximintegrated.com/en/ds/MAX7219-MAX7221.pdf; Temperature Range Low: 0°C; Device Class L1: Integrated Circuits (ICs); ComponentLink2Description: Datasheet; Digikey Description: IC DRVR 7 SEGMNT 8 DIGIT 24SOIC; Mouser Description: In a Tube of 30, Maxim MAX7221CWG+, LED Driver, 8-Digits 64-Segments, 5 V, 24-Pin SOIC W; RoHS: TRUE; Octopart: https://octopart.com/max7221cwg%2B-maxim+integrated-39581478; Automotive: No; Footprint Url: https://pdfserv.maximintegrated.com/land_patterns/90-0182.PDF

## Nets that join several sheets
+5: ATMEGA328PB_example (C18.2 U4.1), USB_C2 (FB?.2)
GND: nRF (34 pins), USB_C (?.1 D3.1), ATMEGA328PB_example (15 pins), componant_example (D?#1.1 D?#2.1 Q1.3 Q2.3), USB_C2 (6 pins), USB_to_UART (U?#1.9 U?#1.17 U?#1.29)
USB: USB_C (J1.A4 J1.A9 J1.B4 J1.B9), USB_C2 (5 pins)
USB_GND: USB_C (7 pins), USB_C2 (7 pins)
VCC: modem (U1.51 U1.52 U1.53), nRF (23 pins), ATMEGA328PB_example (8 pins), componant_example (R2.2 R3.2)
CS: ATMEGA328PB_example (U3.12), SPI_8_bit display (U?#2.12)
DC_N: USB_C2 (FL1.2), USB_to_UART (R?#4.1)
DC_P: USB_C2 (FL1.3), USB_to_UART (R?#5.1)
MOSI: ATMEGA328PB_example (U3.15), SPI_8_bit display (U?#2.1)
PC0: ATMEGA328PB_example (U3.23), componant_example (Q1.2)
PC1: ATMEGA328PB_example (U3.24), componant_example (Q2.2)
SCLK: ATMEGA328PB_example (U3.17), SPI_8_bit display (U?#2.13)